# EAGLE design blue (EAGLE 9.5.1)
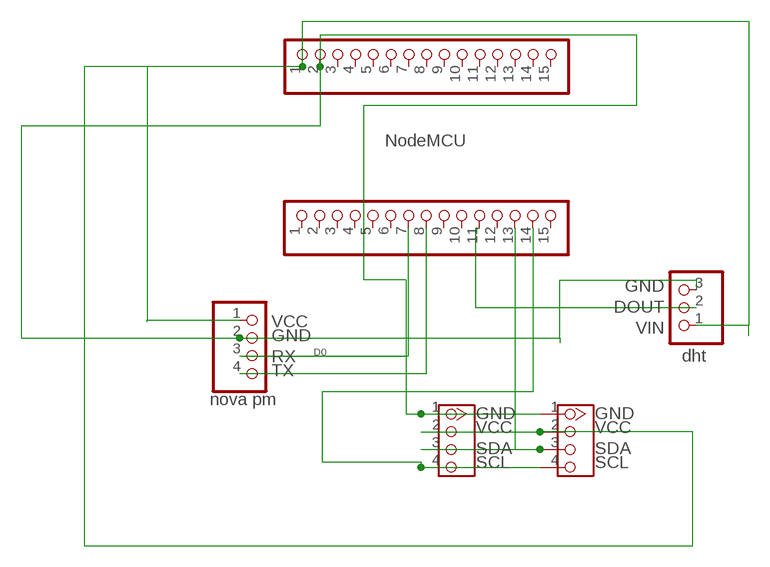
[diagram p0: schematic, sheet 1]

## Parts
J1  4P-2.0  GROVE-CONNECTOR-DIP(4P-2.0)  [HW4-2.0]
J2  4P-2.0  GROVE-CONNECTOR-DIP(4P-2.0)  [HW4-2.0]
JP1  PINHD-1X15  [1X15]
JP2  PINHD-1X15  [1X15]
JP3  PINHD-1X3  [1X03]
JP4  PINHD-1X4  [1X04]

## Nets
N$3: JP1.11 JP3.2
N$4: JP1.8 JP4.4
N$5: JP1.7 JP4.3
N$6: J1.2 J2.2 JP2.1 JP3.1 JP4.1
N$7: J1.4 J2.4 JP1.14
N$8: J1.3 J2.3 JP1.13
N$9: J1.1 J2.1 JP2.2 JP3.3 JP4.2
Unconnected: JP1.1 JP1.2 JP1.3 JP1.4 JP1.5 JP1.6 JP1.9 JP1.10 JP1.12 JP1.15 JP2.3 JP2.4 JP2.5 JP2.6 JP2.7 JP2.8 JP2.9 JP2.10 JP2.11 JP2.12 JP2.13 JP2.14 JP2.15

## Notes on the sheet
- NodeMCU
- GND
- DOUT
- VIN
- VCC
- GND
- dht
- D0
- RX
- TX
- nova pm
- GND | GND
- VCC | VCC
- SDA | SDA
- SCL | SCL

## Library data of the parts
J1 J2 = OPL_Connector:GROVE-CONNECTOR-DIP(4P-2.0): 320110033
JP1 JP2 = pinhead:PINHD-1X15: PIN HEADER
JP3 = pinhead:PINHD-1X3: PIN HEADER
JP4 = pinhead:PINHD-1X4: PIN HEADER

## Board
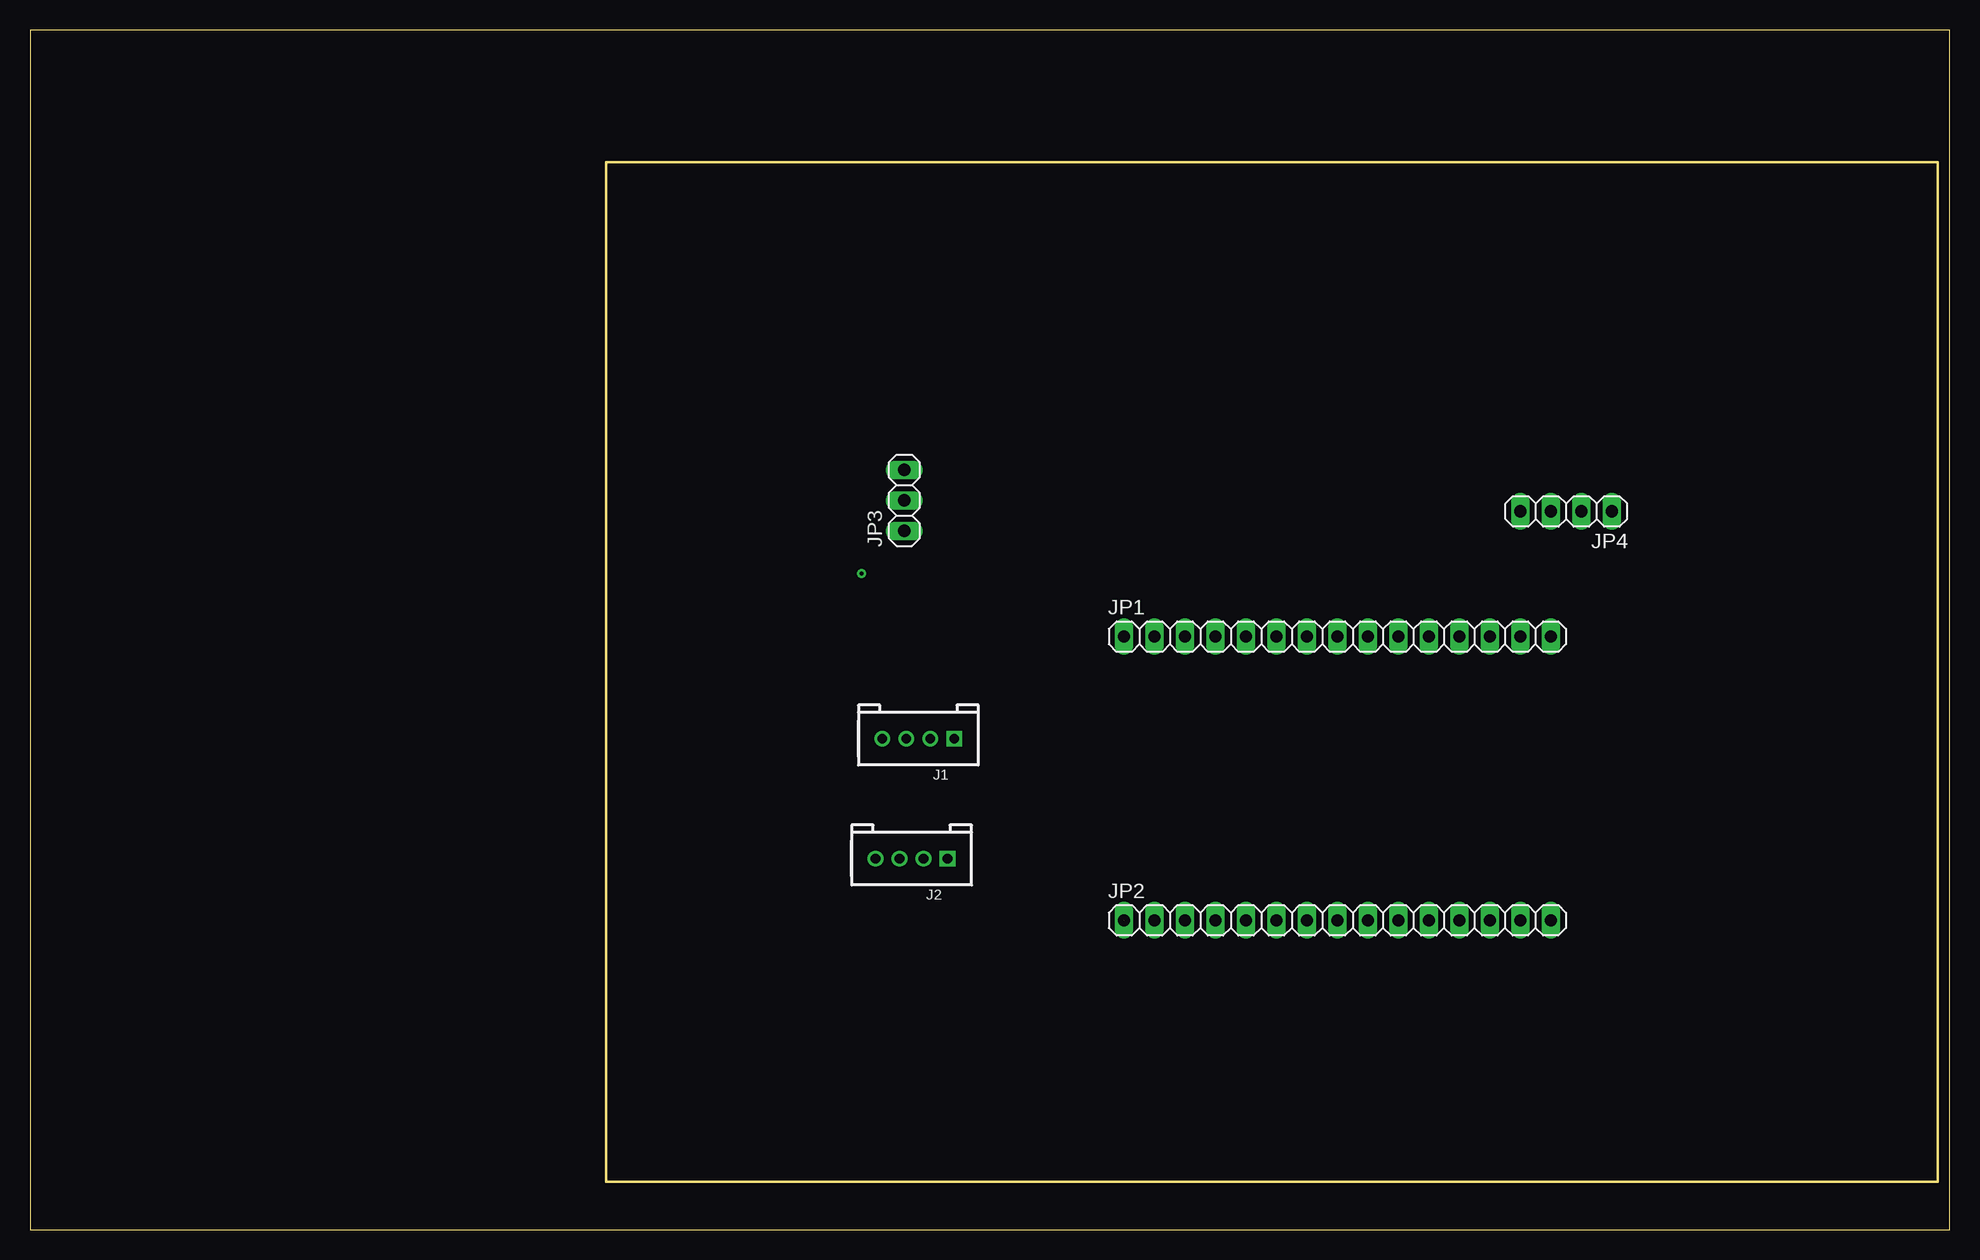
[diagram p1: board, top side]
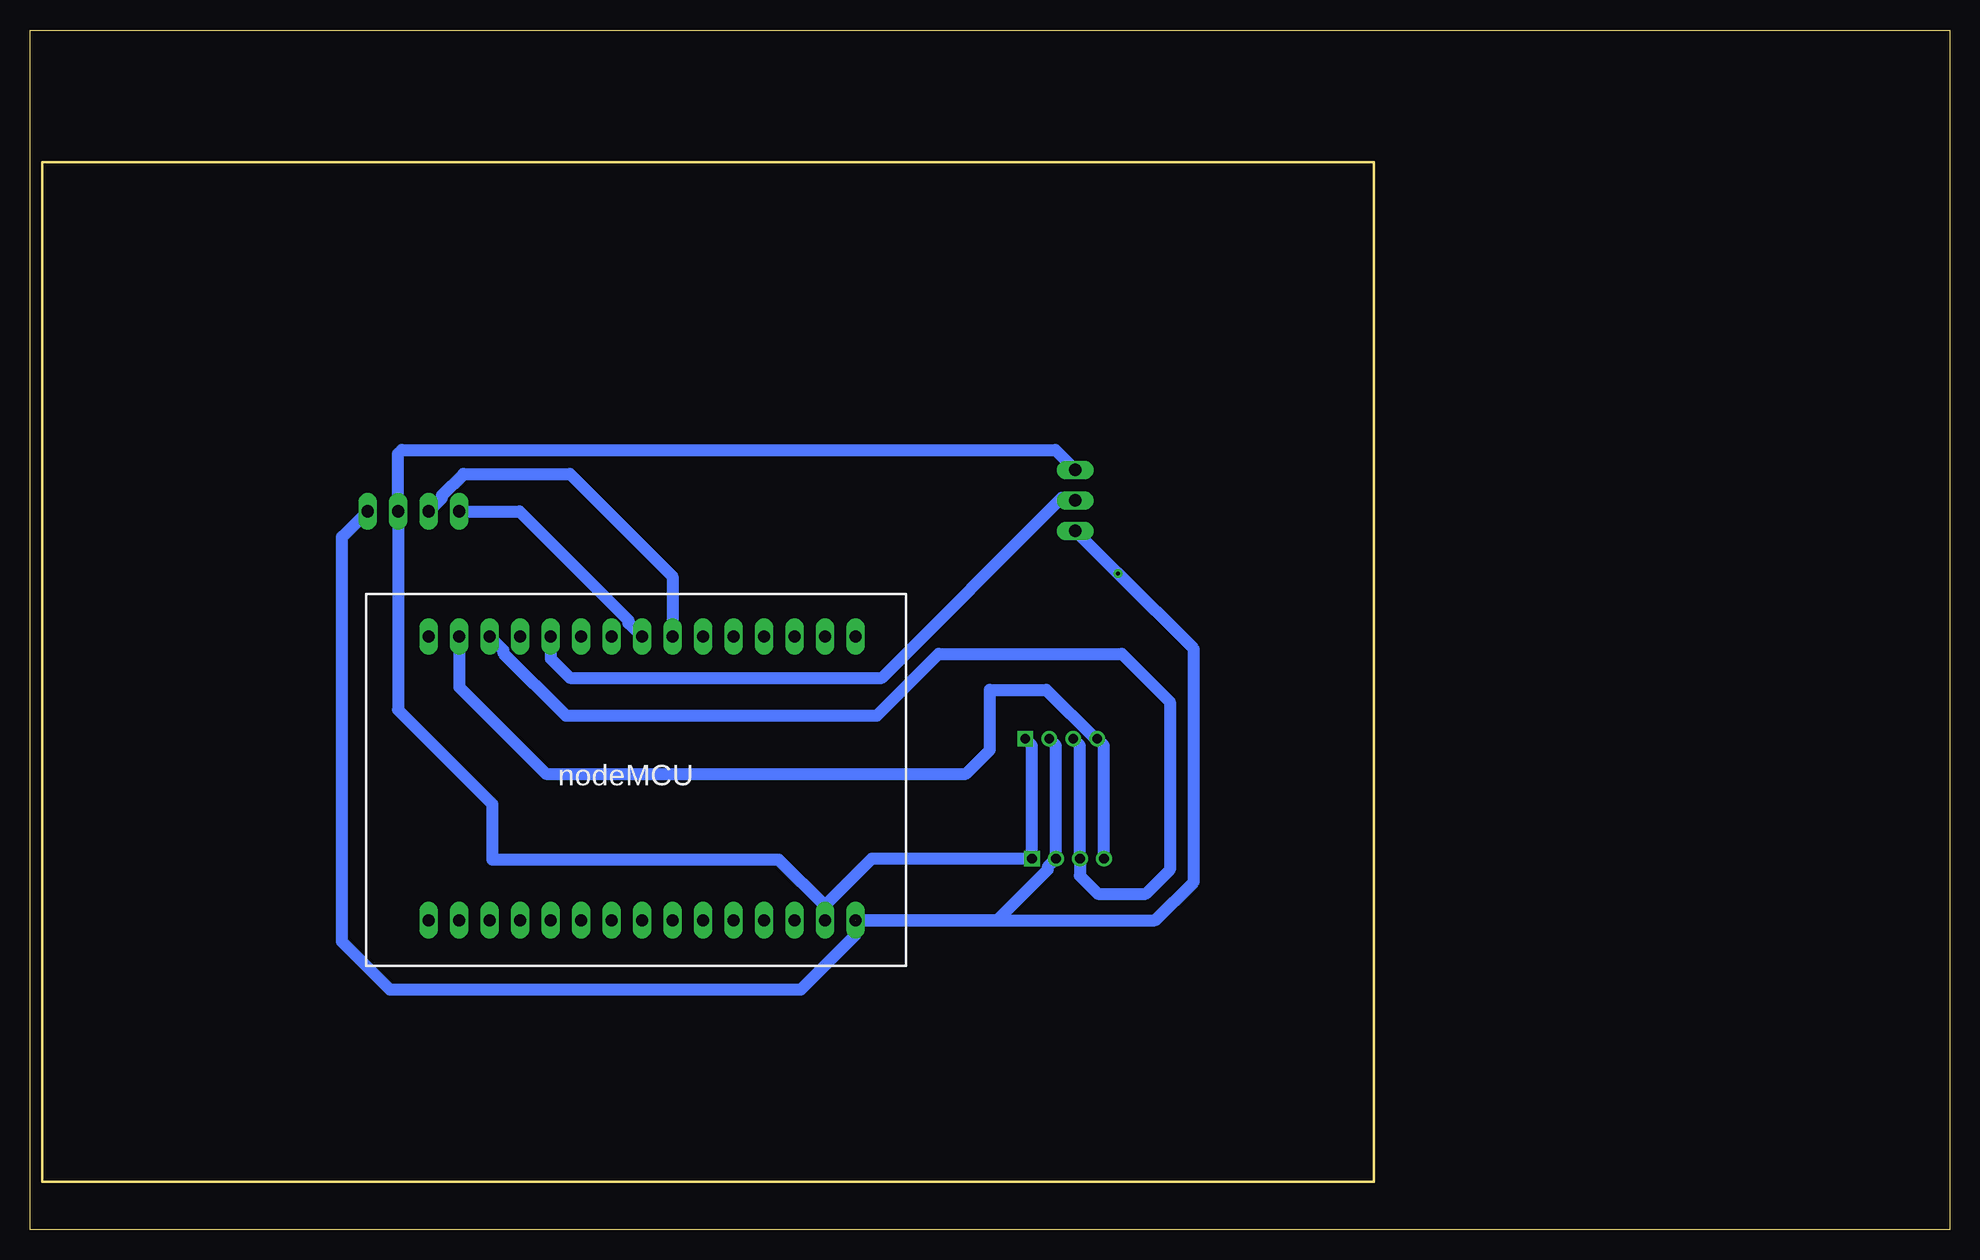
[diagram p2: board, bottom side, seen from below]

Size 160 x 100 mm. Coordinates in mm from the lower left corner, seen from the top.
Outline: 0,0 160,0 160,100 0,100 0,0
Outline: 48,4 48,89 159,89 159,4 48,4
Copper layers (1*16): Top 0.035mm / dielectric 1.5mm / Bottom 0.035mm
Design rules "default": minimum track width 6mil, minimum drill 0.35mm, track to track 6mil, track to pad 6mil, pad to pad 6mil, via to via 6mil, smd to smd 6mil, copper to edge 40mil, drill to drill 6mil, minimum pad ring 10mil, minimum via ring 8mil, stop-mask expansion 4mil, vias tented up to drill 0mil, thermal gap 10mil

### Footprints (pad centres in the part's own frame; a part is rotated, then mirrored left to right if it is on the bottom)
HW4-2.0 = drill 0.8 pad 1.27 square: 1 -3,0 | drill 0.8 pad 1.27: 2 -1,0; 3 1,0; 4 3,0
1X15 = drill 1.016 long: 1 -17.78,0; 2 -15.24,0; 3 -12.7,0; 4 -10.16,0; 5 -7.62,0; 6 -5.08,0; 7 -2.54,0; 8 0,0; 9 2.54,0; 10 5.08,0; 11 7.62,0; 12 10.16,0; 13 12.7,0; 14 15.24,0; 15 17.78,0
1X03 = drill 1.016 long: 1 -2.54,0; 2 0,0; 3 2.54,0
1X04 = drill 1.016 long: 1 -3.81,0; 2 -1.27,0; 3 1.27,0; 4 3.81,0

### Placement (x,y rotation side)
J1  74.05,40.92 180 top
J2  73.48,30.92 180 top
JP1  108.98,49.43 0 top
JP2  108.98,25.78 0 top
JP3  72.87,60.79 90 top
JP4  128.05,59.87 180 top

### Tracks (layer width: path | path; a pad name or v marks a point on that pad's centre or on a via)
N$3
  Bottom 1: JP1.11 116.6,47.6 115,46 89,46 74.21,60.79 | 74,61 74.21,60.79 | JP3.2 74.21,60.79
N$4
  Bottom 1: JP1.8 110.11,50.56 110.11,50.78 119.2,59.87 JP4.4
N$5
  Bottom 1: JP4.3 125.65,61 125.65,61.22 123.87,63 115,63 106.44,54.44 JP1.7
N$6  (via drill 0.35)  (1 unrouted)
  Bottom 1: JP2.1 66.22,25.78 63,29 63,48.38 v69.31,54.69 JP3.1 | JP2.1 91.2,24.56 95.76,20 130,20 134,24 134,57.73 JP4.1 | J1.2 74.48,40.35 J2.2 75.17,30.23 75.17,30 79.39,25.78 JP2.1
N$7
  Bottom 1: J2.4 70.48,40.35 J1.4 71.2,40.92 75.28,45 80,45 80,40 82,38 117,38 124.22,45.22 JP1.14
N$8
  Bottom 1: 73.2,40.92 J1.3 72.48,40.35 J2.3 72.48,29.48 71,28 67,28 65,30 65,44 69,48 84.25,48 89.41,42.85 115.32,42.85 120.55,48.08 120.55,48.3 JP1.13
N$9
  Bottom 1: J1.1 76.48,40.35 J2.1 89.82,30.92 93.61,27.13 93.61,25.91 JP2.2 93.74,27 97.58,30.85 121.48,30.85 121.48,35.48 129.32,43.32 JP4.2 129.32,64.68 129,65 74.54,65 JP3.3

### Text on the board
bNames: nodeMCU